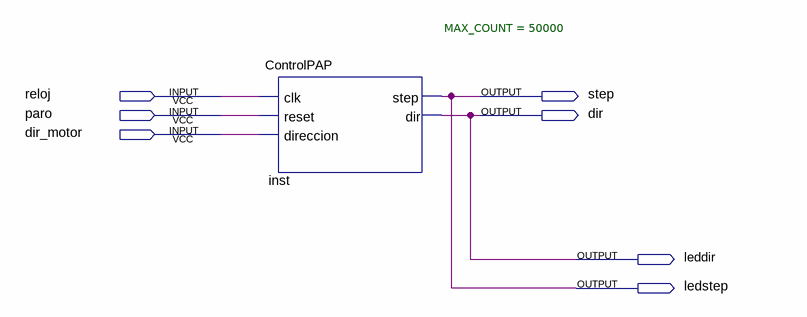
[diagram p0: schematic sheet]
// Quartus schematic GeneralControlScheme.bdf as structural Verilog: 1 symbols, 7 pins
module GeneralControlScheme (
  input  reloj,
  input  paro,
  input  dir_motor,
  output step,
  output dir,
  output leddir,
  output ledstep
);

  ControlPAP #(.MAX_COUNT(50000)) inst (.clk(reloj), .reset(paro), .direccion(dir_motor), .step(ledstep), .dir(dir));

  assign leddir = dir;
  assign step = ledstep;
endmodule
